# EAGLE design sensnodeTXv4 (EAGLE 6.6.0)
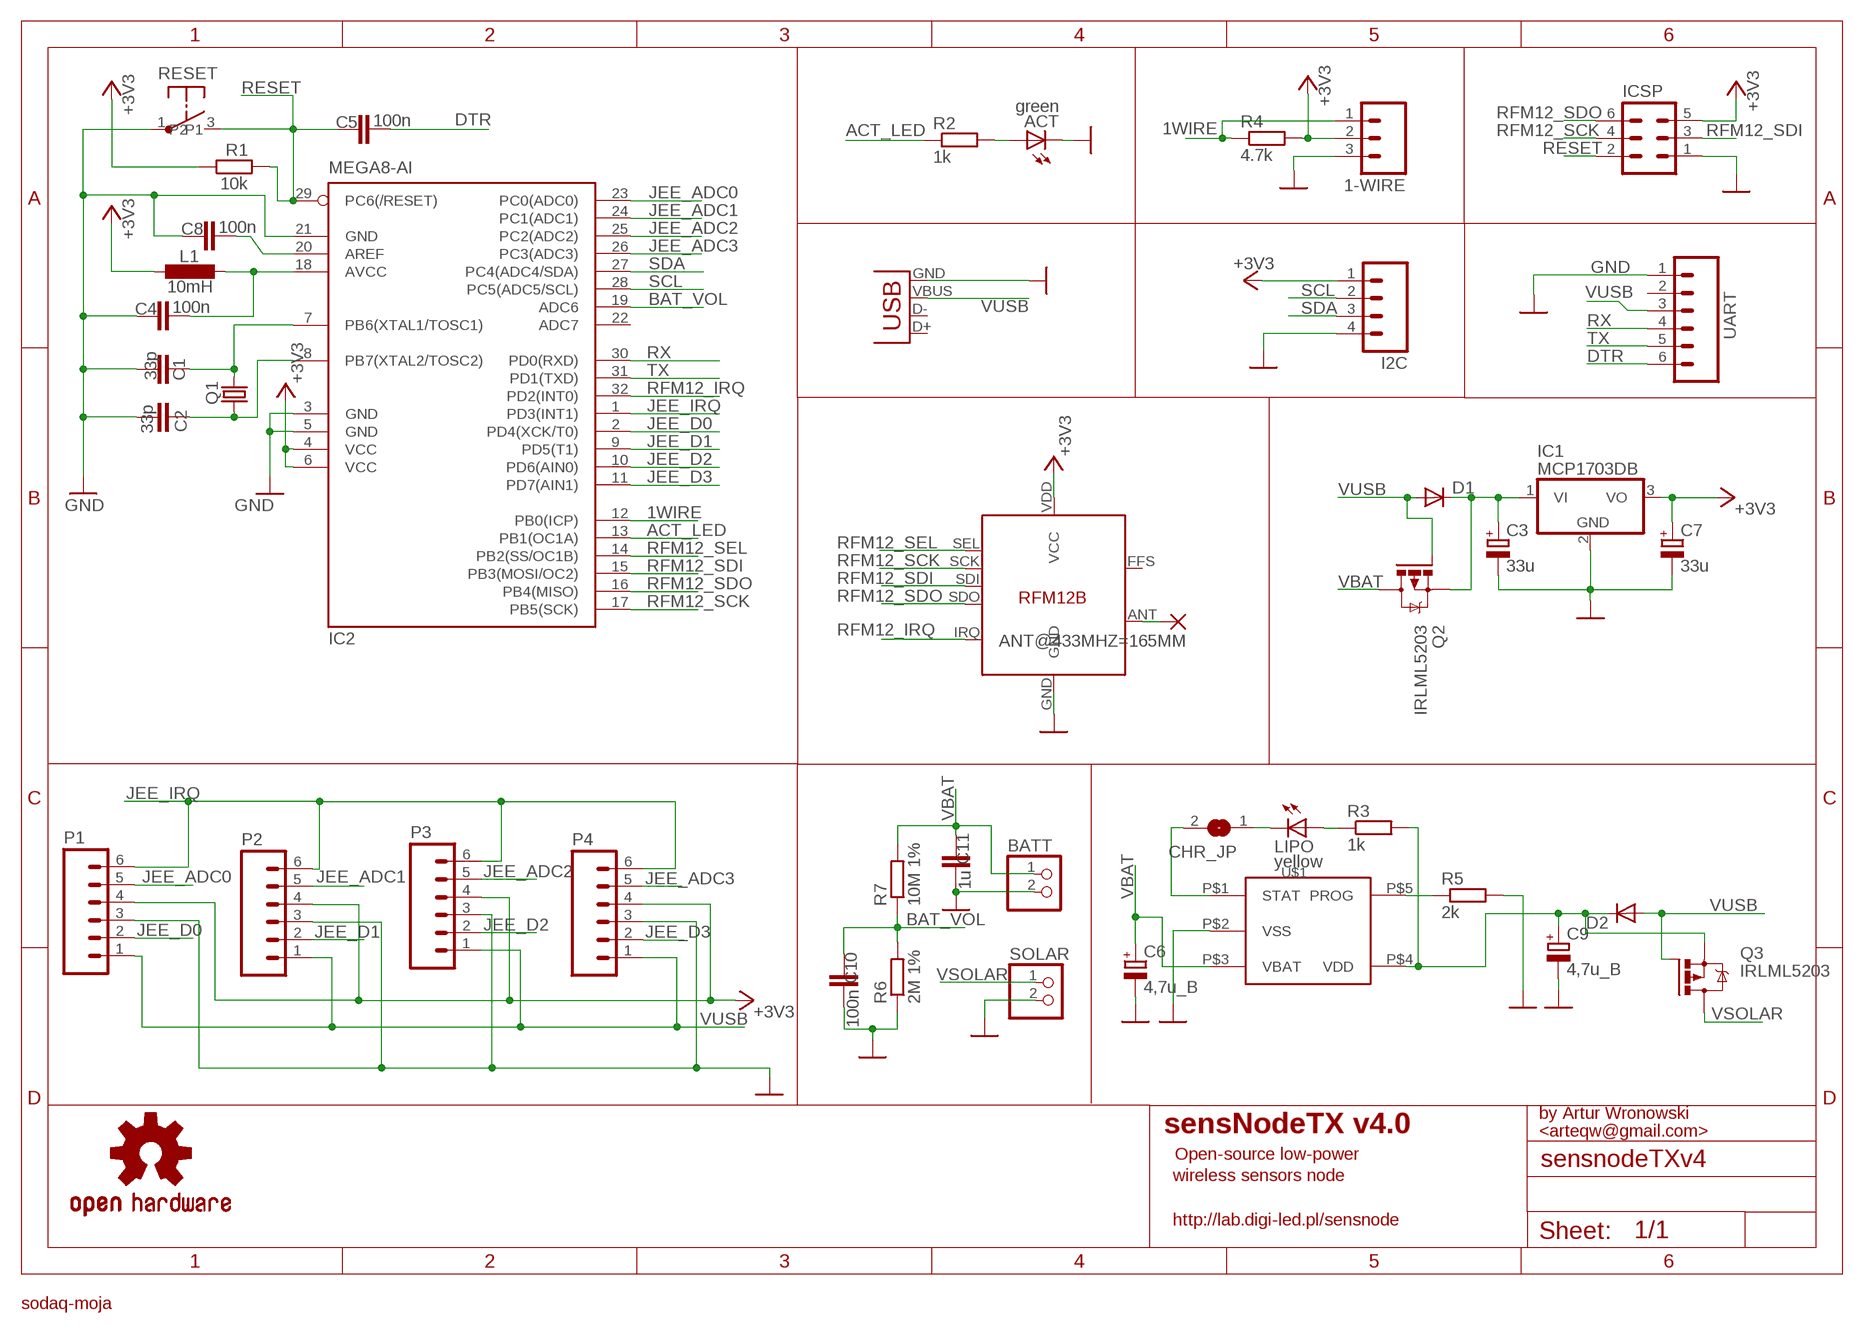
[diagram p0: schematic, sheet 1]

## Parts
1-WIRE  M03LOCK  [1X03_LOCK]
ACT  green  LEDSMT1206  [1206]
ANT@433MHZ=165MM  2,15/1,0  [2,15/1,0]
BATT  PINHD-1X2  [1X02]
C1  33p  C-EUC0805  [C0805]
C2  33p  C-EUC0805  [C0805]
C3  33u  CPOL-EUSMCB  [SMC_B]
C4  100n  C-EUC0805  [C0805]
C5  100n  C-EUC0805  [C0805]
C6  4,7u_B  CPOL-EUSMCB  [SMC_B]
C7  33u  CPOL-EUSMCB  [SMC_B]
C8  100n  C-EUC0805  [C0805]
C9  4,7u_B  CPOL-EUSMCB  [SMC_B]
C10  100n  C-EUC0805  [C0805]
C11  1u  C-EUC0805  [C0805]
CHR_JP  JUMPER  [SJW]
D1  1n5819 melf  DIODE-MELF-MLL41  [MELF-MLL41]
D2  1n5819 melf  DIODE-MELF-MLL41  [MELF-MLL41]
I2C  M04LOCK  [1X04_LOCK]
IC1  MCP1703DB  [SOT223]
IC2  MEGA8-AI  [TQFP32-08]
ICSP  MA03-2  [MA03-2]
L1  10mH  L-EU0207/7  [0207/7]
LIPO  yellow  LEDSMT1206  [1206]
P1  M06SIP_LOCK  [1X06-SIP_LOCK]
P2  M06SIP_LOCK  [1X06-SIP_LOCK]
P3  M06SIP_LOCK  [1X06-SIP_LOCK]
P4  M06SIP_LOCK  [1X06-SIP_LOCK]
Q1  CRYSTALHC49U70  [HC49U70]
Q2  IRLML5203  [MICRO3]
Q3  IRLML5203  [MICRO3]
R1  10k  R-EU_M0805  [M0805]
R2  1k  R-EU_M0805  [M0805]
R3  1k  R-EU_M0805  [M0805]
R4  4.7k  R-EU_M0805  [M0805]
R5  2k  R-EU_M0805  [M0805]
R6  2M 1%  R-EU_M0805  [M0805]
R7  10M 1%  R-EU_M0805  [M0805]
RESET  TACT3X6  [TACK3X6]
RFM12B  RFM12B  [RFM12B]
SOLAR  PINHD-1X2  [1X02]
U$1  MCP73831  [5PIN_SOT23]
U$3  OSHW-LOGOM  [OSHW-LOGO-M]
UART  M06SIP_LOCK  [1X06-SIP_LOCK]
USB_PWR  USBSMD  [USB-MINIB]

## Nets
1WIRE: 1-WIRE.1 IC2.12(PB0(ICP)) R4.1
+3V3: 1-WIRE.2 C7.+ I2C.1 IC1.3(VO) IC2.4(VCC) IC2.6(VCC) ICSP.5 L1.1 P1.4 P2.4 P3.4 P4.4 R1.1 R4.2 RFM12B.VDD(VCC)
ACT_LED: IC2.13(PB1(OC1A)) R2.1
BAT_VOL: C10.2 IC2.19(ADC6) R6.2 R7.1
DTR: C5.1 UART.6
GND: 1-WIRE.3 ACT.C BATT.2 C1.2 C2.2 C3.- C4.2 C6.- C7.- C8.2 C9.- C10.1 C11.1 I2C.4 IC1.2(GND) IC2.3(GND) IC2.5(GND) IC2.21(GND) ICSP.1 P1.3 P2.3 P3.3 P4.3 R5.2 R6.1 RESET.1 RFM12B.GND SOLAR.2 U$1.P$2(VSS) UART.1 USB_PWR.GND
JEE_ADC0: IC2.23(PC0(ADC0)) P1.5
JEE_ADC1: IC2.24(PC1(ADC1)) P2.5
JEE_ADC2: IC2.25(PC2(ADC2)) P3.5
JEE_ADC3: IC2.26(PC3(ADC3)) P4.5
JEE_D0: IC2.2(PD4(XCK/T0)) P1.2
JEE_D1: IC2.9(PD5(T1)) P2.2
JEE_D2: IC2.10(PD6(AIN0)) P3.2
JEE_D3: IC2.11(PD7(AIN1)) P4.2
JEE_IRQ: IC2.1(PD3(INT1)) P1.6 P2.6 P3.6 P4.6
N$1: C2.1 IC2.8(PB7(XTAL2/TOSC2)) Q1.1
N$2: C1.1 IC2.7(PB6(XTAL1/TOSC1)) Q1.2
N$3: C4.1 IC2.18(AVCC) L1.2
N$4: C8.1 IC2.20(AREF)
N$5: LIPO.A R3.1
N$6: CHR_JP.2 U$1.P$1(STAT)
N$7: C9.+ D2.C Q3.2(S) R3.2 U$1.P$4(VDD)
N$8: ACT.A R2.2
N$9: R5.1 U$1.P$5(PROG)
N$10: CHR_JP.1 LIPO.C
N$12: C3.+ D1.C IC1.1(VI) Q2.2(S)
N$24: ANT@433MHZ=165MM.1(P) RFM12B.ANT
RESET: C5.2 IC2.29(PC6(/RESET)) ICSP.2 R1.2 RESET.3(P2)
RFM12_IRQ: IC2.32(PD2(INT0)) RFM12B.IRQ
RFM12_SCK: IC2.17(PB5(SCK)) ICSP.4 RFM12B.SCK
RFM12_SDI: IC2.15(PB3(MOSI/OC2)) ICSP.3 RFM12B.SDI
RFM12_SDO: IC2.16(PB4(MISO)) ICSP.6 RFM12B.SDO
RFM12_SEL: IC2.14(PB2(SS/OC1B)) RFM12B.SEL
RX: IC2.30(PD0(RXD)) UART.4
SCL: I2C.2 IC2.28(PC5(ADC5/SCL))
SDA: I2C.3 IC2.27(PC4(ADC4/SDA))
TX: IC2.31(PD1(TXD)) UART.5
VBAT: BATT.1 C6.+ C11.2 Q2.3(D) R7.2 U$1.P$3(VBAT)
VSOLAR: Q3.3(D) SOLAR.1
VUSB: D1.A D2.A P1.1 P2.1 P3.1 P4.1 Q2.1(G) Q3.1(G) UART.3 USB_PWR.VBUS
Unconnected: IC2.22(ADC7) RFM12B.FFS UART.2 USB_PWR.D+ USB_PWR.D-

## Notes on the sheet
- by Artur Wronowski
- sensNodeTX v4.0 | <arteqw@gmail.com>
- Open-source low-power
- wireless sensors node
- http://lab.digi-led.pl/sensnode
- sodaq-moja

## Library data of the parts
1-WIRE = SparkFun:M03: Header 3 Standard 3-pin 0.1" header. Use with straight break away headers (SKU : PRT-00116), right angle break away headers (PRT-00553), swiss pins (PRT-00743), machine pins (PRT-00117), and female headers (PRT-00115). Molex polarized connector foot print use with SKU : PRT-08232 with associated crimp pins and housings.
ACT LIPO = adafruit:LED: LED OSRAM: - CHIPLED LG R971, LG N971, LY N971, LG Q971, LY Q971, LO R971, LY R971 LH N974, LH R974 LS Q976, LO Q976, LY Q976 LO Q996 - Hyper CHIPLED LW Q18S LB Q993, LB Q99A, LB R99A - SideLED LS A670, LO A670, LY A670, LG A670, LP A670 LB A673, LV A673, LT A673, LW A673 LH A674 LY A675 LS A676, LA A676, LO A676, LY A676, LW A676 LS A679, LY A679, LG A679 - Hyper Micro SIDELED® LS Y876, LA Y876, LO Y876, LY Y876 LT Y87S - SmartLED LW L88C, LW L88S LB L89C, LB L89S, LG L890 LS L89K, LO L89K, LY L89K LS L896, LA L896, LO L896, LY L896 - TOPLED LS T670, LO T670, LY T670, LG T670, LP T670 LSG T670, LSP T670, LSY T670, LOP T670, LYG T670 LG T671, LOG T671, LSG T671 LB T673, LV T673, LT T673, LW T673 LH T674 LS T676, LA T676, LO T676, LY T676, LB T676, LH T676, LSB T676, LW T676 LB T67C, LV T67C, LT T67C, LS T67K, LO T67K, LY T67K, LW E67C LS E67B, LA E67B, LO E67B, LY E67B, LB E67C, LV E67C, LT E67C LW T67C LS T679, LY T679, LG T679 LS T770, LO T770, LY T770, LG T770, LP T770 LB T773, LV T773, LT T773, LW T773 LH T774 LS E675, LA E675, LY E675, LS T675 LS T776, LA T776, LO T776, LY T776, LB T776 LHGB T686 LT T68C, LB T68C - Hyper Mini TOPLED® LB M676 - Mini TOPLED Santana® LG M470 LS M47K, LO M47K, LY M47K Source: http://www.osram.convergy.de/
ANT@433MHZ=165MM = wirepad:2,15/1,0: THROUGH-HOLE PAD
BATT SOLAR = pinhead:PINHD-1X2: PIN HEADER
C1 C2 C4 C5 C8 C10 C11 = resistor:C-EU: CAPACITOR, European symbol
C3 C6 C7 C9 = resistor:CPOL-EU: POLARIZED CAPACITOR, European symbol
CHR_JP = BaseApp:JUMPER
D1 D2 = diode:DIODE-: DIODE
I2C = SparkFun:M04: Header 4 Standard 4-pin 0.1" header. Use with straight break away headers (SKU : PRT-00116), right angle break away headers (PRT-00553), swiss pins (PRT-00743), machine pins (PRT-00117), and female headers (PRT-00115). Molex polarized connector foot print use with SKU : PRT-08231 with associated crimp pins and housings. 1MM SMD Version SKU: PRT-10208
IC1 = linear:MCP1703: 250 mA, 16V, Low Quiescent Current LDO Regulator Source: http://ww1.microchip.com/downloads/en/DeviceDoc/22049b.pdf
IC2 = atmel:MEGA8: MICROCONTROLLER 8 Kbytes FLASH, 1 kbytes SRAM, 512 bytes EEPROM, USART, 6-channel 10 bit ADC, 2-channel 8 bit ADC Pin compatible with Atmega48, ATMega88, ATMega168 Source: avr.lbr; MPN: ATMEGA8-16AU; OC_FARNELL: 9171371; OC_NEWARK: 73M8863
ICSP = con-lstb:MA03-2: PIN HEADER; OC_FARNELL: unknown; OC_NEWARK: unknown
L1 = resistor:L-EU: INDUCTOR, European symbol
P1-P4 UART = SparkFun:M06: Header 6 Standard 6-pin 0.1" header. Use with straight break away headers (SKU : PRT-00116), right angle break away headers (PRT-00553), swiss pins (PRT-00743), machine pins (PRT-00117), and female headers (PRT-00115). Molex polarized connector foot print use with SKU : PRT-08094 with associated crimp pins and housings. NOTES ON THE VARIANTS LOCK and LOCK_LONGPADS... This footprint was designed to help hold the alignment of a through-hole component (i.e. 6-pin header) while soldering it into place. You may notice that each hole has been shifted either up or down by 0.005 of an inch from it's more standard position (which is a perfectly straight line). This slight alteration caused the pins (the squares in the middle) to touch the edges of the holes. Because they are alternating, it causes a "brace" to hold the component in place. 0.005 has proven to be the perfect amount of "off-center" position when using our standard breakaway headers. Although looks a little odd when you look at the bare footprint, once you have a header in there, the alteration is very hard to notice. Also, if you push a header all the way into place, it is covered up entirely on the bottom side. This idea of altering the position of holes to aid alignment will be further integrated into the Sparkfun Library for other footprints. It can help hold any component with 3 or more connection pins.
Q1 = crystal:CRYSTAL: CRYSTAL; OC_FARNELL: unknown; OC_NEWARK: unknown
Q2 Q3 = transistor-power:IRLML5203: HEXFET P-Channel Power MOSFET
R1-R7 = resistor:R-EU_: RESISTOR, European symbol
RESET = artek:TACT3X6
RFM12B = JeeParts:RFM12B
U$1 = BaseApp:MCP73831: Digikey No:- __MCP73831T-2ACI/OTCT-ND__
U$3 = SparkFun:OSHW-LOGO: Open Source Hardware Logo This logo indicates the piece of hardware it is found on incorporates a OSHW license and/or adheres to the definition of open source hardware found here: http://freedomdefined.org/OSHW
USB_PWR = SparkFun:USB: USB Connectors USB-B-PTH is fully proven SKU : PRT-00139 USB-miniB is fully proven SKU : PRT-00587 USB-A-PCB is untested. USB-A-H is throughly reviewed, but untested. Spark Fun Electronics SKU : PRT-00437 USB-B-SMT is throughly reviewed, but untested. Needs silkscreen touching up. USB-A-S has not been used/tested USB-MB-H has not been used/tested

## Board
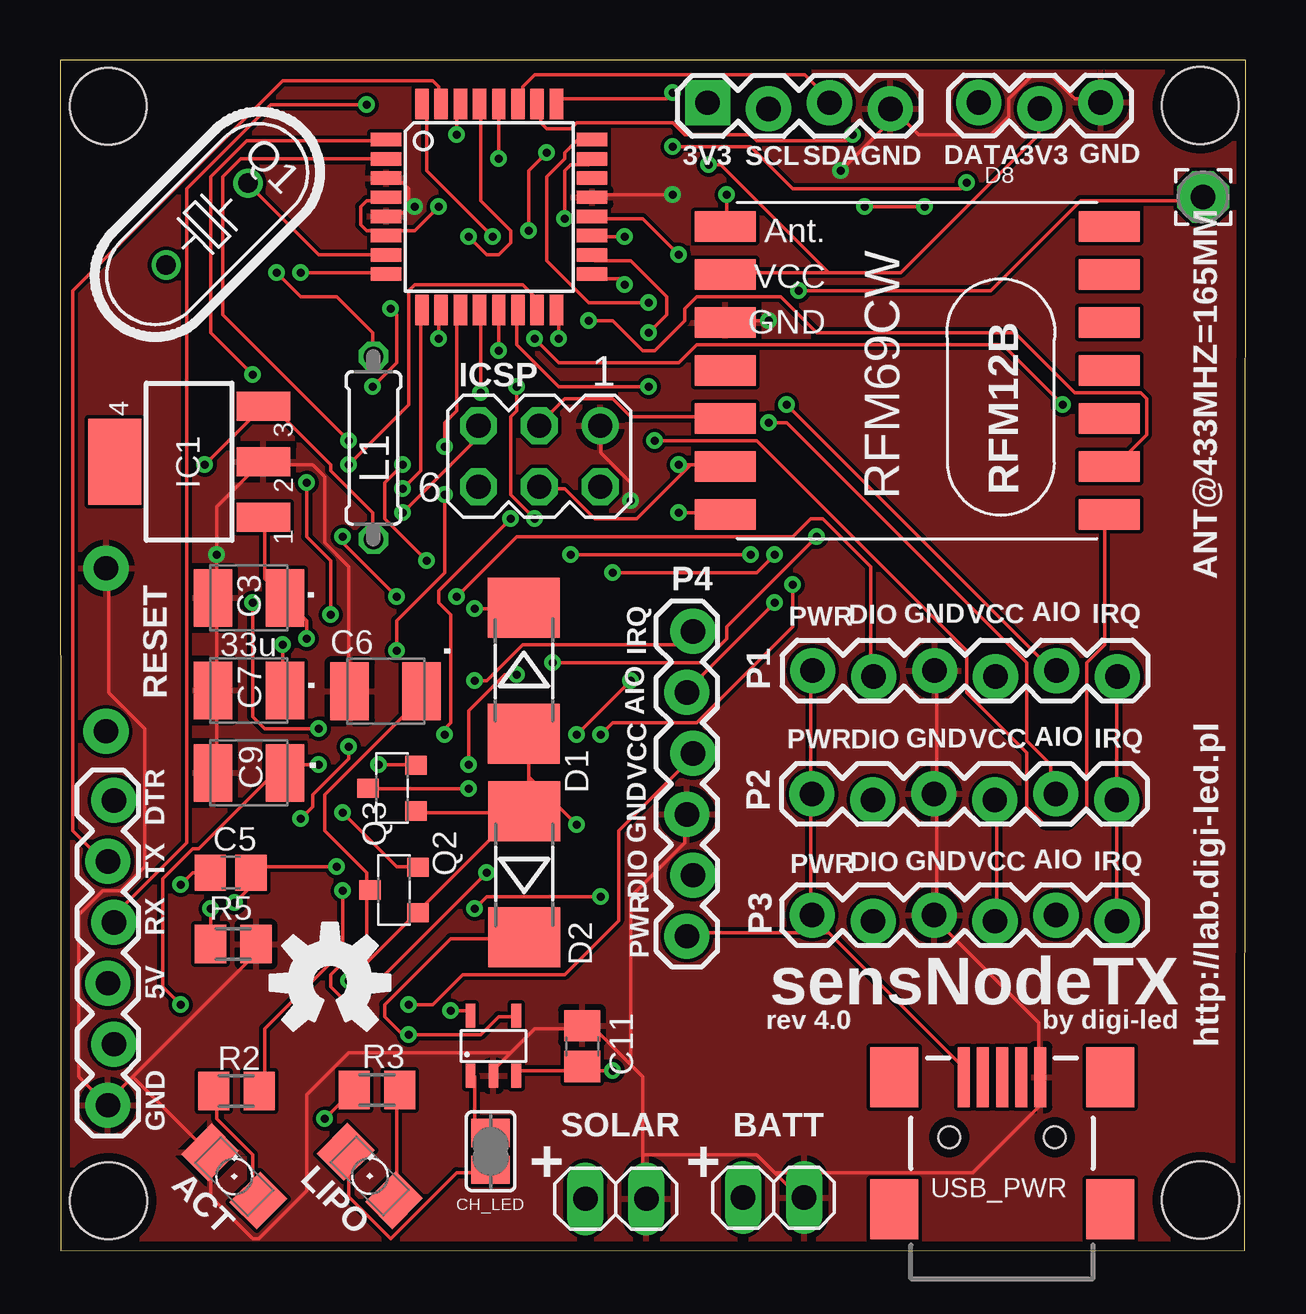
[diagram p1: board, top side]
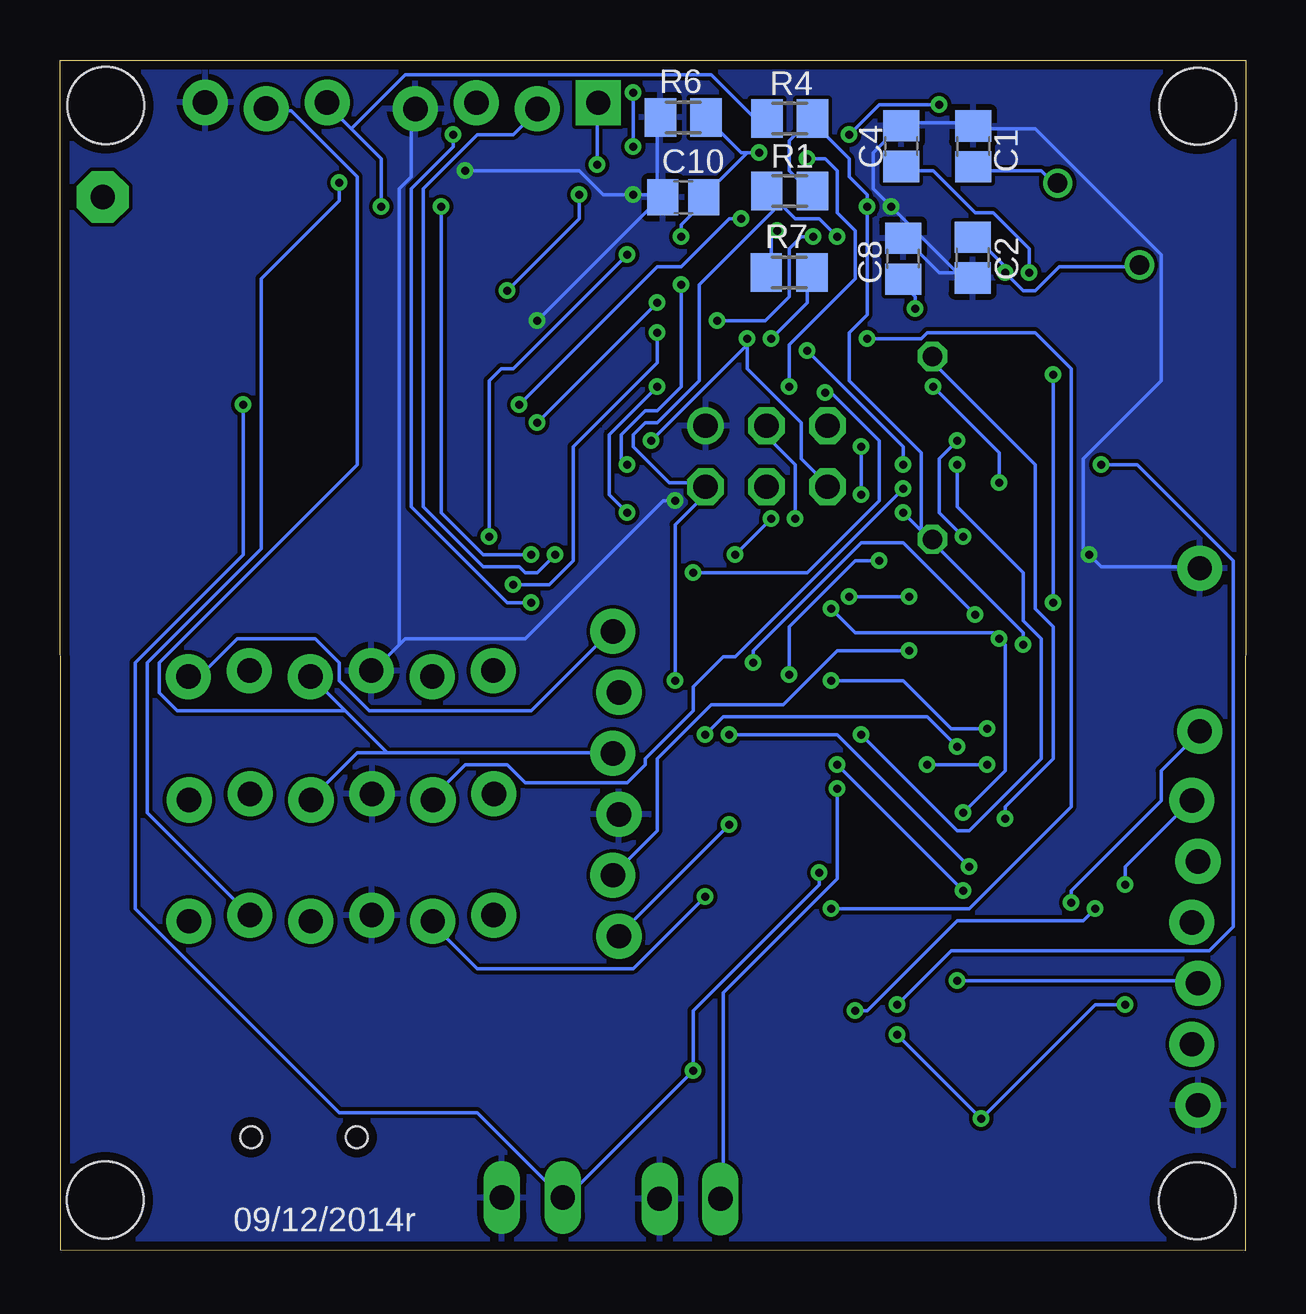
[diagram p2: board, bottom side, seen from below]

Size 49.41 x 49.61 mm. Coordinates in mm from the lower left corner, seen from the top.
Outline: 0.03,0 49.37,0.02 49.41,49.61 0,49.61 0.03,0
Copper layers (1*16): Top 0.0356mm / dielectric 1.5011mm / Bottom 0.0356mm
Design rules "LaenPCBOrder": minimum track width 6mil, minimum drill 13mil, track to track 6mil, track to pad 6mil, pad to pad 6mil, via to via 6mil, smd to smd 6mil, copper to edge 15mil, drill to drill 6mil, minimum pad ring 7mil, minimum via ring 7mil, stop-mask expansion 3mil, vias tented up to drill 0mil, thermal gap 10mil
Holes 3.2 mm at 2.02,2.08 47.51,47.71 2.01,47.68 47.52,2.11

### Footprints (pad centres in the part's own frame; a part is rotated, then mirrored left to right if it is on the bottom)
1X03_LOCK = drill 1.016 pad 1.88: 1 0,0.127; 2 2.54,-0.127; 3 5.08,0.127
1206 = smd 1.6 x 1.803: A -1.422,0; C 1.422,0
2,15/1,0 = drill 1.016 pad 2.159 octagon: 1 0,0
1X02 = drill 1.016 long: 1 -1.27,0; 2 1.27,0
C0805 = smd 1.3 x 1.5: 1 -0.85,0; 2 0.85,0
SMC_B = smd 1.6 x 2.4: + -1.5,0; - 1.5,0
SJW = smd 1.168 x 1.6: 1 -0.762,0; 2 0.762,0
MELF-MLL41 = smd 2.5 x 3: A 2.625,0; C -2.625,0
1X04_LOCK = drill 1.016 pad 1.88 square: 1 0,0.127 | drill 1.016 pad 1.88: 2 2.54,-0.127; 3 5.08,0.127; 4 7.62,-0.127
SOT223 = smd 1.219 x 2.235: 1 -2.311,-3.099; 2 0,-3.099; 3 2.311,-3.099 | smd 3.6 x 2.2: 4 0,3.099
TQFP32-08 = smd 1.27 x 0.559: 1 -4.293,2.8; 2 -4.293,2; 3 -4.293,1.2; 4 -4.293,0.4; 5 -4.293,-0.4; 6 -4.293,-1.2; 7 -4.293,-2; 8 -4.293,-2.8; 17 4.293,-2.8; 18 4.293,-2; 19 4.293,-1.2; 20 4.293,-0.4; 21 4.293,0.4; 22 4.293,1.2; 23 4.293,2; 24 4.293,2.8 | smd 0.559 x 1.27: 9 -2.8,-4.293; 10 -2,-4.293; 11 -1.2,-4.293; 12 -0.4,-4.293; 13 0.4,-4.293; 14 1.2,-4.293; 15 2,-4.293; 16 2.8,-4.293; 25 2.8,4.293; 26 2,4.293; 27 1.2,4.293; 28 0.4,4.293; 29 -0.4,4.293; 30 -1.2,4.293; 31 -2,4.293; 32 -2.8,4.293
MA03-2 = drill 1.016: 1 -2.54,-1.27 | drill 1.016 octagon: 2 -2.54,1.27; 3 0,-1.27; 4 0,1.27; 5 2.54,-1.27; 6 2.54,1.27
0207/7 = drill 0.813 octagon: 1 -3.81,0; 2 3.81,0
1X06-SIP_LOCK = drill 1.016 pad 1.88: 1 0,0; 2 2.54,-0.254; 3 5.08,0; 4 7.62,-0.254; 5 10.16,0; 6 12.7,-0.254
HC49U70 = drill 0.813: 1 -2.413,0; 2 2.413,0
MICRO3 = smd 0.8 x 0.9: 1 -0.95,-1; 2 0.95,-1; 3 0,1
M0805 = smd 1.3 x 1.6: 1 -0.95,0; 2 0.95,0
TACK3X6 = drill 1.016 pad 1.88: 1 -1.981,3.261; 3 -1.981,-3.531
RFM12B = smd 2.54 x 1.27: ANT 8,-6; FFS -8,2; GND 8,-2; IRQ -8,4; P$8 -8,0; P$9 -8,-2; P$10 -8,-4; P$12 -8,-6; P$16 8,0; SCK 8,4; SDI 8,2; SDO -8,6; SEL 8,6; VDD 8,-4
5PIN_SOT23 = smd 0.4 x 1: P$1 0.4,-0.63; P$2 1.35,-0.63; P$3 2.3,-0.63; P$4 2.3,1.87; P$5 0.4,1.87
USB-MINIB = smd 2.5 x 0.5: D+ 2.5,0; D- 2.5,0.8; GND 2.5,-1.6; ID 2.5,-0.8; VBUS 2.5,1.6 | smd 2.5 x 2: MTN1 -3,4.5; MTN2 2.5,4.5; MTN3 -3,-4.5; MTN4 2.5,-4.5 | hole 0.9: 0,2.2; 0,-2.2

### Placement (x,y rotation side)
1-WIRE  38.28,47.71 0 top
ACT  7.26,3.09 135 top
ANT@433MHZ=165MM  47.63,43.9 0 top
BATT  29.73,2.21 0 top
C1  11.36,46.01 90 bottom
C2  11.38,41.38 270 bottom
C3  7.87,27.2 180 top
C4  14.36,46.02 90 bottom
C5  7.11,15.75 0 top
C6  13.57,23.31 180 top
C7  7.87,23.34 180 top
C8  14.28,41.33 90 bottom
C9  7.87,19.91 180 top
C10  23.44,43.89 0 bottom
C11  21.76,8.52 270 top
CHR_JP  17.94,4.14 90 top
D1  19.33,24.16 270 top
D2  19.34,15.69 90 top
I2C  26.98,47.7 0 top
IC1  5.38,32.87 90 top
IC2  17.88,43.49 0 top
ICSP  19.97,33.1 180 top
L1  13.06,33.45 90 top
LIPO  12.91,3.11 135 top
P1  31.36,24.17 0 top
P2  31.33,19.03 0 top
P3  31.34,13.98 0 top
P4  26.12,13.1 90 top
Q1  6.13,42.77 45 top
Q2  13.92,15.03 90 top
Q3  13.83,19.27 90 top
R1  19.01,44.15 180 bottom
R2  7.35,6.64 180 top
R3  13.21,6.69 180 top
R4  19,47.18 0 bottom
R5  7.22,12.77 0 top
R6  23.44,47.22 0 bottom
R7  19.03,40.76 0 bottom
RESET  3.9,25.17 0 top
RFM12B  35.71,36.67 180 top
SOLAR  23.16,2.16 0 top
U$1  16.71,7.91 0 top
U$3  11.25,11.16 0 top
UART  1.99,6.06 90 top
USB_PWR  39.25,4.73 90 top

### Tracks (layer width: path | path; a pad name or v marks a point on that pad's centre or on a via)
1WIRE  (via drill 0.33)
  Top 0.152: v17.53,35.75 17.53,39 IC2.12 | v23.03,28.25 29.03,28.25 v29.78,29 | v36.03,43.5 v33.53,43.5
  Bottom 0.152: v17.53,35.75 17.28,35.75 15.28,33.75 15.28,31.25 18.28,28.25 v23.03,28.25 | v29.78,29 31.78,29 33.53,30.75 v33.53,43.5 | v36.03,43.5 36.03,45.5 37.28,46.75 | 37.28,46.75 38.28,47.75 1-WIRE.1 | 37.28,46.75 35.03,49 22.28,49 20.53,47.25 20.03,47.25 R4.1
+3V3  (via drill 0.33)
  Top 0.152: IC2.4 13.53,43.75 12.78,43.75 12.53,43.5 12.53,42.75 12.78,42.5 13.53,42.5 IC2.6 13.78,42.5 14.78,42.5 v15.78,43.5 | L1.1 13.03,29.75 13.03,30.75 11.28,32.5 11.28,32.75 9.03,35 8.53,35 IC1.3 8.28,35 v6.03,32.75 | v9.28,25.25 9.28,23.5 C7.+ | v14.28,30.75 17.28,33.75 17.28,34.25 ICSP.5 | 32.03,40.75 35.03,40.75 40.78,46.5 40.78,47.5 1-WIRE.2 | 32.03,40.75 27.78,40.75 RFM12B.VDD | v27.03,45.25 27.53,45.25 32.03,40.75 | P3.4 39.03,13.75 39.03,18.75 P2.4 | v14.53,10.25 15.53,10.25 16.78,11.5 21.03,11.5 23.28,13.75 23.28,17.5 26.28,20.5 P4.4
  Bottom 0.152: R1.1 18.28,44.25 19.03,45 19.03,46.25 18.28,47 R4.2 18.03,47 16.53,45.5 16.53,44.75 15.78,44 v15.78,43.5 15.78,39 16.53,38.25 16.53,36.25 13.53,33.25 13.53,30 | v9.28,25.25 9.28,25.75 13.03,29.5 L1.1 | 13.53,30 13.28,29.75 L1.1 | 13.53,30 v14.28,30.75 | 13.53,30 L1.1 | v27.03,45.25 27.03,47.75 I2C.1 | 35.78,20.75 37.03,20.75 38.78,19 P2.4 | 35.78,20.75 26.53,20.75 P4.4 | 35.78,20.75 37.53,22.5 | 37.53,22.5 38.78,23.75 P1.4 | 37.53,22.5 44.53,22.5 45.28,23.25 45.28,24.5 37.03,32.75 37.03,44.75 39.78,47.5 40.78,47.5 1-WIRE.2 | v6.03,32.75 4.53,32.75 0.53,28.75 0.53,13.5 1.53,12.5 12.28,12.5 v14.53,10.25
ACT_LED  (via drill 0.33)
  Top 0.152: v18.28,37.5 IC2.13 | v14.28,32.75 13.53,32 13.53,30.5 v15.28,28.75 | v19.03,24 18.53,24 17.03,22.5 v17.03,20.25 | v11.78,15 11.78,12.5 8.53,9.25 8.53,6.75 R2.1
  Bottom 0.152: v18.28,37.5 14.28,33.5 v14.28,32.75 | v15.28,28.75 16.28,28.75 19.03,26 v19.03,24 | v11.78,15 v17.03,20.25
BAT_VOL  (via drill 0.33)
  Top 0.152: v23.53,42.25 22.28,42.25 IC2.19 | v19.53,42.5 19.53,45 v20.28,45.75
  Bottom 0.152: v23.53,42.25 23.53,42.75 22.53,43.75 C10.2 22.53,44 20.78,45.75 | v19.53,42.5 19.78,42.25 19.78,41 R7.1 | 20.78,45.75 21.03,45.75 22.28,47 R6.2 | 20.78,45.75 v20.28,45.75
DTR  (via drill 0.33)
  Top 0.152: v5.03,15.25 5.53,15.75 6.03,15.75 C5.1
  Bottom 0.152: v5.03,15.25 5.03,16 2.28,18.75 UART.6
GND  (via drill 0.33)
  Top 0.152: v25.53,44 22.28,44 IC2.21 | v29.53,38.75 27.78,38.75 RFM12B.GND | v23.78,31.25 23.78,32 22.53,33.25 22.53,34.25 ICSP.1 | P1.3 36.53,24 36.53,19.25 P2.3 36.53,19 36.53,14 P3.3 36.53,13.75 40.78,9.5 40.78,7.25 USB_PWR.GND 40.78,7 40.78,6 38.03,3.25 29.78,3.25 | 1-WIRE.3 43.28,48 42.28,48 41.28,49 40.53,49 39.53,48 39.53,47.25 38.78,46.5 35.78,46.5 34.78,47.5 I2C.4 34.53,47.5 34.53,47 v32.53,45 | 14.53,43.5 14.28,43.25 13.78,43.25 IC2.5 | 14.53,43.5 14.53,44.25 14.28,44.5 13.78,44.5 IC2.3 | v14.78,43.5 14.53,43.5 | C9.- 6.53,20 6.53,23.25 C7.- 6.53,23.5 6.53,27 C3.- 6.53,27.25 v6.53,29 6.53,31 8.28,32.75 IC1.2 8.53,32.75 10.53,32.75 11.03,32.25 11.03,29.5 12.03,28.5 12.03,23.5 C6.- | 3.03,7.25 2.03,6.25 UART.1 1.78,6.25 0.78,7.25 0.78,14 1.78,15 2.53,15 3.53,16 3.53,21.75 2.03,23.25 2.03,28.25 RESET.1 | 3.03,7.25 8.03,12.25 8.03,12.75 R5.2 | 3.03,7.25 6.03,4.25 ACT.C 6.28,4 6.28,2.25 8.03,0.5 8.28,0.5 10.28,2.5 10.28,6.5 12.03,8.25 18.78,8.25 | 18.78,8.25 19.78,9.25 21.53,9.25 C11.1 21.78,9.25 22.28,9.25 23.78,7.75 | 18.78,8.25 18.03,7.5 U$1.P$2 | 24.28,4 24.28,7.25 23.78,7.75 | 24.28,4 24.28,2.25 SOLAR.2 | 29.78,3.25 29.03,4 24.28,4 | 29.78,3.25 30.78,2.25 BATT.2 | 23.78,7.75 23.78,14.75 26.03,17 26.03,18 P4.3
  Bottom 0.152: 24.53,44 v25.53,44 26.78,44 27.78,45 v32.53,45 | 24.53,44 24.53,47 R6.1 | 24.53,44 C10.1 24.53,43.75 v29.53,38.75 | v23.78,31.25 24.28,31.25 30.03,25.5 35.03,25.5 35.28,25.25 | 35.28,25.25 36.28,24.25 P1.3 | 35.28,25.25 35.28,44.25 34.78,44.75 34.78,47.5 I2C.4 | 12.03,40.75 12.78,40.75 14.28,42.25 C8.2 | 12.03,40.75 11.53,40.75 C2.2 12.03,40.75 | 12.03,40.75 v14.78,43.5 15.53,44.25 15.53,45.75 14.53,46.75 C4.2 14.28,47 11.53,47 C1.2 11.28,46.75 8.78,46.75 3.53,41.5 3.53,36.25 6.78,33 6.78,29.25 v6.53,29 6.03,28.5 2.03,28.5 RESET.1
  pour Bottom (isolate 0.1): 0.03,49.59 49.34,49.59 49.34,0.04 0.03,0.04
  pour Top (isolate 0.1): 0.05,49.62 49.37,49.62 49.37,0.01 0.05,0.01
JEE_ADC0  (via drill 0.33)
  Top 0.152: v21.03,43 21.03,45 21.28,45.25 22.03,45.25 IC2.23 | v30.28,35.25 41.28,24.25 P1.5
  Bottom 0.152: v21.03,43 21.53,43 23.53,41 24.53,41 v30.28,35.25
JEE_ADC1  (via drill 0.33)
  Top 0.152: v24.53,39.5 22.03,39.5 20.28,41.25 20.28,44.75 21.03,45.5 21.03,45.75 21.53,46.25 22.03,46.25 IC2.24 | v29.53,34.5 30.28,34.5 40.28,24.5 40.28,21.25 41.28,20.25 41.28,19.25 P2.5
  Bottom 0.152: v29.53,34.5 v24.53,39.5
JEE_ADC2  (via drill 0.33)
  Top 0.152: v25.53,48.25 25.28,48 20.78,48 IC2.25 | v25.53,46 28.78,46 30.53,44.25 37.53,44.25 v37.78,44.5
  Bottom 0.152: v25.53,46 v25.53,48.25 | v37.78,44.5 37.78,43.75 41.03,40.5 41.03,29.25 45.78,24.5 45.78,18.25 41.53,14 P3.5
JEE_ADC3  (via drill 0.33)
  Top 0.152: v33.03,46.5 32.78,46.25 29.03,46.25 28.78,46.5 26.03,46.5 25.53,47 21.53,47 21.28,46.75 20.28,46.75 20.03,47 20.03,47.75 IC2.26 | v29.78,27 26.28,23.5 P4.5
  Bottom 0.152: v33.03,46.5 33.03,46 34.78,44.25 34.78,31 30.78,27 v29.78,27
JEE_D0  (via drill 0.33)
  Top 0.152: v12.03,33.75 6.78,39 6.78,44.75 7.53,45.5 13.53,45.5 IC2.2 | v11.78,29.75 11.78,29.5 v14.03,27.25 | v16.53,27.25 19.03,29.75 30.53,29.75 31.28,30.5 31.78,30.5 33.78,28.5 33.78,24 P1.2
  Bottom 0.152: v12.03,33.75 12.78,33 12.78,30.75 v11.78,29.75 | v16.53,27.25 v14.03,27.25
JEE_D1  (via drill 0.33)
  Top 0.152: v14.28,31.75 15.03,32.5 15.03,39 IC2.9
  Bottom 0.152: v14.28,31.75 21.28,24.75 21.78,24.75 23.03,23.5 23.03,22.5 25.03,20.5 25.03,20.25 25.78,19.5 30.03,19.5 30.78,20.25 32.53,20.25 33.78,19 P2.2
JEE_D2  (via drill 0.33)
  Top 0.152: v15.78,38 15.78,39 IC2.10 | v17.28,14.25 17.78,14.75 v22.53,14.75
  Bottom 0.152: v15.78,38 13.53,38 13.28,38.25 8.78,38.25 7.28,36.75 7.28,18.5 11.53,14.25 v17.28,14.25 | v22.53,14.75 25.53,11.75 32.03,11.75 33.78,13.5 P3.2
JEE_D3  (via drill 0.33)
  Top 0.152: v16.03,33.5 16.03,34.5 16.53,35 16.53,39 IC2.11 | v16.03,31.5 16.03,28.25 14.03,26.25 v14.03,25
  Bottom 0.152: v16.03,31.5 v16.03,33.5 | v14.03,25 17.03,25 19.28,22.75 22.28,22.75 24.53,20.5 24.53,17.5 26.28,15.75 P4.2
JEE_IRQ  (via drill 0.33)
  Top 0.152: P1.6 44.03,23.75 P2.6 44.03,13.75 P3.6 | v8.03,36.5 6.28,38.25 6.28,44.75 7.78,46.25 13.53,46.25 IC2.1 | v8.03,27 8.03,22.25 8.53,21.75 v10.78,21.75 | v17.28,23.75 17.78,23.75 19.28,25.25 25.78,25.25 26.28,25.75 P4.6
  Bottom 0.152: v8.03,27 v8.03,36.5 | v10.78,21.75 12.28,21.75 14.28,23.75 v17.28,23.75 | P1.6 44.03,24 43.53,24 42.03,25.5 38.78,25.5 37.78,24.5 37.78,23.75 36.53,22.5 29.78,22.5 26.53,25.75 P4.6
N$1  (via drill 0.33)
  Top 0.152: v10.03,40.75 13.53,40.75 IC2.8
  Bottom 0.152: C2.1 11.28,42.25 10.03,41 v10.03,40.75 9.28,40 8.78,40 7.78,41 4.53,41 Q1.1
N$2
  Top 0.152: IC2.7 13.53,41.5 10.78,41.5 8.03,44.25 Q1.2
  Bottom 0.152: C1.1 11.28,45 8.53,45 8.03,44.5 Q1.2
N$3  (via drill 0.33)
  Top 0.152: v24.53,38.25 25.28,39 25.28,39.75 23.78,41.25 22.28,41.25 IC2.18 | v30.53,27.75 30.53,26 26.53,22 23.03,22 v22.53,21.5 | v12.03,21 12.03,20.5 10.53,19 10.53,18.5 v10.03,18 | v9.03,40.75 10.03,39.75 11.53,39.75 13.03,38.25 13.03,37.5 L1.2
  Bottom 0.152: v24.53,38.25 24.53,37 28.03,33.5 28.03,28.75 29.03,27.75 v30.53,27.75 | v22.53,21.5 21.78,22.25 13.28,22.25 v12.03,21 | v10.03,18 10.03,18.5 8.03,20.5 8.03,26 8.78,26.75 8.78,32.75 13.28,37.25 L1.2 | v9.03,40.75 9.03,41.75 10.53,43.25 11.28,43.25 13.03,45 14.28,45 C4.1
N$4  (via drill 0.33)
  Top 0.152: v25.78,41.5 24.28,43 22.28,43 IC2.20 | v31.53,29.75 27.78,26 27.78,25.5 26.78,24.5 v20.53,24.5 | v11.28,26.5 11.28,28.75 10.28,29.75 v10.28,32 | v13.03,36 14.03,37 14.03,39 v13.78,39.25
  Bottom 0.152: v25.78,41.5 30.53,36.75 31.03,36.75 31.53,36.25 v31.53,29.75 | v20.53,24.5 20.53,25 16.03,29.5 14.28,29.5 v11.28,26.5 | v10.28,32 10.28,33.25 v13.03,36 | v13.78,39.25 13.78,39.75 14.28,40.25 C8.1
N$5
  Top 0.152: R3.1 14.03,6.5 14.03,2.25 LIPO.A
N$6
  Top 0.152: U$1.P$1 17.28,7.25 17.28,5.5 17.78,5 CHR_JP.2
N$7  (via drill 0.33)
  Top 0.152: v13.28,20.25 14.78,20.25 Q3.2 | v10.78,20.25 9.78,20.25 9.53,20 C9.+ 9.28,19.75 8.78,19.75 5.78,16.75 5.53,16.75 4.28,15.5 4.28,11 v5.03,10.25 | U$1.P$4 19.03,9.75 18.28,9.75 17.53,9 v14.53,9 14.28,9 13.53,9.75 13.53,10.25 16.28,13 19.28,13 D2.C | v11.03,5.5 12.03,6.5 R3.2
  Bottom 0.152: v10.78,20.25 v13.28,20.25 | v14.53,9 v11.03,5.5 6.28,10.25 v5.03,10.25
N$8
  Top 0.152: R2.2 6.53,6.5 6.53,5.5 8.03,4 8.03,2.25 ACT.A
N$9  (via drill 0.33)
  Top 0.152: v16.28,10 17.03,10 U$1.P$5 | v6.28,14.25 6.28,13 R5.1
  Bottom 0.152: v16.28,10 15.78,10 12.03,13.75 6.78,13.75 v6.28,14.25
N$10
  Top 0.152: CHR_JP.1 17.78,3.25 16.53,3.25 13.78,0.5 12.03,2.25 12.03,4 LIPO.C
N$12  (via drill 0.33)
  Top 0.152: v11.78,18.25 14.03,16 14.78,16 Q2.2 | v10.28,25.5 10.28,26.25 9.53,27 C3.+ 9.28,27.25 8.53,28 8.53,30.5 IC1.1 | v17.28,26.75 19.28,26.75 D1.C
  Bottom 0.152: v11.78,18.25 10.03,20 10.03,25.25 v10.28,25.5 10.53,25.75 16.28,25.75 v17.28,26.75
N$24  (via drill 0.33)
  Top 0.152: v27.78,44 27.78,42.75 RFM12B.ANT | v30.78,40 38.78,40 42.53,43.75 47.53,43.75 ANT@433MHZ=165MM.1
  Bottom 0.152: v27.78,44 27.78,43 v30.78,40
RESET  (via drill 0.33)
  Top 0.152: v7.28,14.5 7.78,15 7.78,15.75 C5.2 8.03,16 v11.53,16 | v17.03,42.25 17.78,41.5 18.28,41.5 18.78,42 18.78,42.5 17.53,43.75 17.53,47.75 IC2.29 | v23.78,23.75 v21.53,21.5
  Bottom 0.152: v7.28,14.5 7.28,15 3.53,18.75 3.53,20 2.03,21.5 RESET.3 | v17.03,42.25 17.78,43 18.78,43 19.28,43.5 | 19.28,43.5 19.78,44 R1.2 | 19.28,43.5 19.53,43.5 22.78,40.25 22.78,36.25 24.53,34.5 25.03,34.5 25.53,34 25.53,33.5 24.03,32 22.53,32 ICSP.2 22.28,31.75 23.78,30.25 v23.78,23.75 | v11.53,16 17.03,21.5 v21.53,21.5
RFM12_IRQ  (via drill 0.33)
  Top 0.152: v18.03,42.25 15.28,45 15.28,47.75 IC2.32 | v22.03,38.75 23.03,38.75 24.28,37.5 24.78,37.5 26.03,38.75 26.03,39.25 26.53,39.75 30.03,39.75 31.53,38.25 39.78,38.25 42.28,35.75 45.03,35.75 45.28,35.5 45.28,34 43.78,32.5 RFM12B.IRQ
  Bottom 0.152: v18.03,42.25 18.53,42.25 19.03,41.75 19.03,39.75 20.03,38.75 v22.03,38.75
RFM12_SCK  (via drill 0.33)
  Top 0.152: v23.53,40.25 23.28,40.5 22.28,40.5 IC2.17 | 26.28,32.75 27.53,32.75 RFM12B.SCK | 26.28,32.75 v25.78,32.75 | 26.28,32.75 24.03,30.5 22.28,30.5 21.03,31.75 20.03,31.75 ICSP.4
  Bottom 0.152: v23.53,40.25 23.53,36 24.53,35 25.03,35 26.03,34 26.03,33 v25.78,32.75
RFM12_SDI  (via drill 0.33)
  Top 0.152: v12.03,32.75 14.53,35.25 14.53,40 14.78,40.25 19.28,40.25 19.78,39.75 19.78,39.25 IC2.15 | v16.03,21.5 16.03,21.75 16.28,22 16.28,26.5 15.78,27 15.78,27.5 v18.78,30.5 | RFM12B.SDI 27.53,34.75 23.78,34.75 23.03,35.5 21.03,35.5 20.03,34.5 ICSP.3
  Bottom 0.152: v12.03,32.75 12.03,31 9.28,28.25 9.28,26.25 8.53,25.5 8.53,20.5 11.53,17.5 12.03,17.5 v16.03,21.5 | v18.78,30.5 18.78,32.75 19.78,33.75 19.78,34.25 ICSP.3
RFM12_SDO  (via drill 0.33)
  Top 0.152: v20.78,38 20.78,39 IC2.16 | v24.78,33.75 29.03,33.75 37.78,25 37.78,23.25 40.28,20.75 40.28,18.5 41.03,17.75 42.03,17.75 42.78,18.5 42.78,24.5 43.53,25.25 43.53,30.5 RFM12B.SDO
  Bottom 0.152: 20.78,37.75 20.78,36.75 18.53,34.5 18.53,33 17.53,32 ICSP.6 | 20.78,37.75 v24.78,33.75 | 20.78,37.75 v20.78,38
RFM12_SEL  (via drill 0.33)
  Top 0.152: v24.53,36 20.78,36 19.03,37.75 19.03,39 IC2.14 | v25.78,30.75 27.53,30.75 RFM12B.SEL
  Bottom 0.152: v24.53,36 26.53,34 26.53,31.5 v25.78,30.75
RX  (via drill 0.33)
  Top 0.152: v16.53,46.5 16.53,47.75 IC2.30 | v12.78,47.75 8.78,47.75 5.28,44.25 5.28,17 2.03,13.75 UART.4
  Bottom 0.152: v16.53,46.5 15.28,47.75 v12.78,47.75
SCL  (via drill 0.33)
  Top 0.152: v18.28,45.5 IC2.28 | v19.03,36 19.03,35 18.78,34.75 18.78,31.5 v19.78,30.5 | v28.78,29 v21.28,29
  Bottom 0.152: v18.28,45.5 17.53,45.5 17.03,45 17.03,43.25 16.28,42.5 16.28,40.5 19.03,37.75 v19.03,36 | v21.28,29 v19.78,30.5 | v28.78,29 29.53,28.25 30.03,28.25 30.28,28.5 31.78,28.5 34.28,31 34.28,44.25 32.03,46.5 30.53,46.5 29.53,47.5 I2C.2
SDA
  Top 0.152: IC2.27 19.28,48 19.28,48.5 19.78,49 31.03,49 32.03,48 I2C.3
TX
  Top 0.152: IC2.31 15.78,48 15.78,48.5 15.53,48.75 9.28,48.75 0.53,40 0.53,17.5 1.78,16.25 UART.5
VBAT  (via drill 0.33)
  Top 0.152: C6.+ 15.28,23.25 11.03,19 11.03,17.5 12.78,15.75 12.78,15.25 Q2.3 12.78,15 12.78,13 11.28,11.5 11.28,11 11.78,10.5 12.53,10.5 v17.78,15.75 | U$1.P$3 19.03,7.5 21.53,7.5 C11.2 21.78,7.5 v23.03,7.5 | v19.78,38 20.78,37 25.78,37 26.53,37.75 39.28,37.75 v41.78,35.25
  Bottom 0.152: v19.78,38 18.28,39.5 18.28,40.75 R7.2 | v41.78,35.25 41.78,29 46.28,24.5 46.28,14.25 37.78,5.75 32.03,5.75 28.53,2.25 BATT.1 28.28,2.25 v23.03,7.5 23.03,10 17.78,15.25 v17.78,15.75
VSOLAR  (via drill 0.33)
  Top 0.152: v17.03,19.25 13.03,19.25 Q3.3
  Bottom 0.152: v17.03,19.25 17.03,15.5 21.78,10.75 21.78,2.25 SOLAR.1
VUSB  (via drill 0.33)
  Top 0.152: P1.1 31.28,24 31.28,19.25 P2.1 31.28,19 31.28,14 P3.1 31.53,13.75 32.03,13.25 | 32.03,13.25 37.53,7.75 37.53,7.25 USB_PWR.VBUS | 32.03,13.25 26.28,13.25 P4.1 | 19.03,18.25 19.28,18.25 D2.A | 19.03,18.25 15.03,18.25 Q3.1 | 19.03,18.25 15.03,14.25 Q2.1 14.78,14 v12.03,11.25 | 19.03,18.25 D2.A | 19.53,19.75 19.53,18.5 D2.A | 19.53,19.75 19.53,21.5 D1.A | 19.53,19.75 v21.53,17.75
  Bottom 0.152: v12.03,11.25 2.03,11.25 UART.3 | v21.53,17.75 26.03,13.25 P4.1

### Text on the board
tNames: 3V3 | SCL | SDA | GND | DATA | 3V3 | GND | D8 | RFM69CW | . | PWR | DIO | GND | VCC | AIO | IRQ | . | IRQ | . | AIO | http://lab.digi-led.pl | PWR | DIO | GND | VCC | AIO | IRQ | . | VCC | DTR | GND | TX | PWR | DIO | GND | VCC | AIO | IRQ | DIO | RX | PWR | sensNodeTX | 5V | rev 4.0 | by digi-led | GND | + | + | CH_LED
bNames: 09/12/2014r